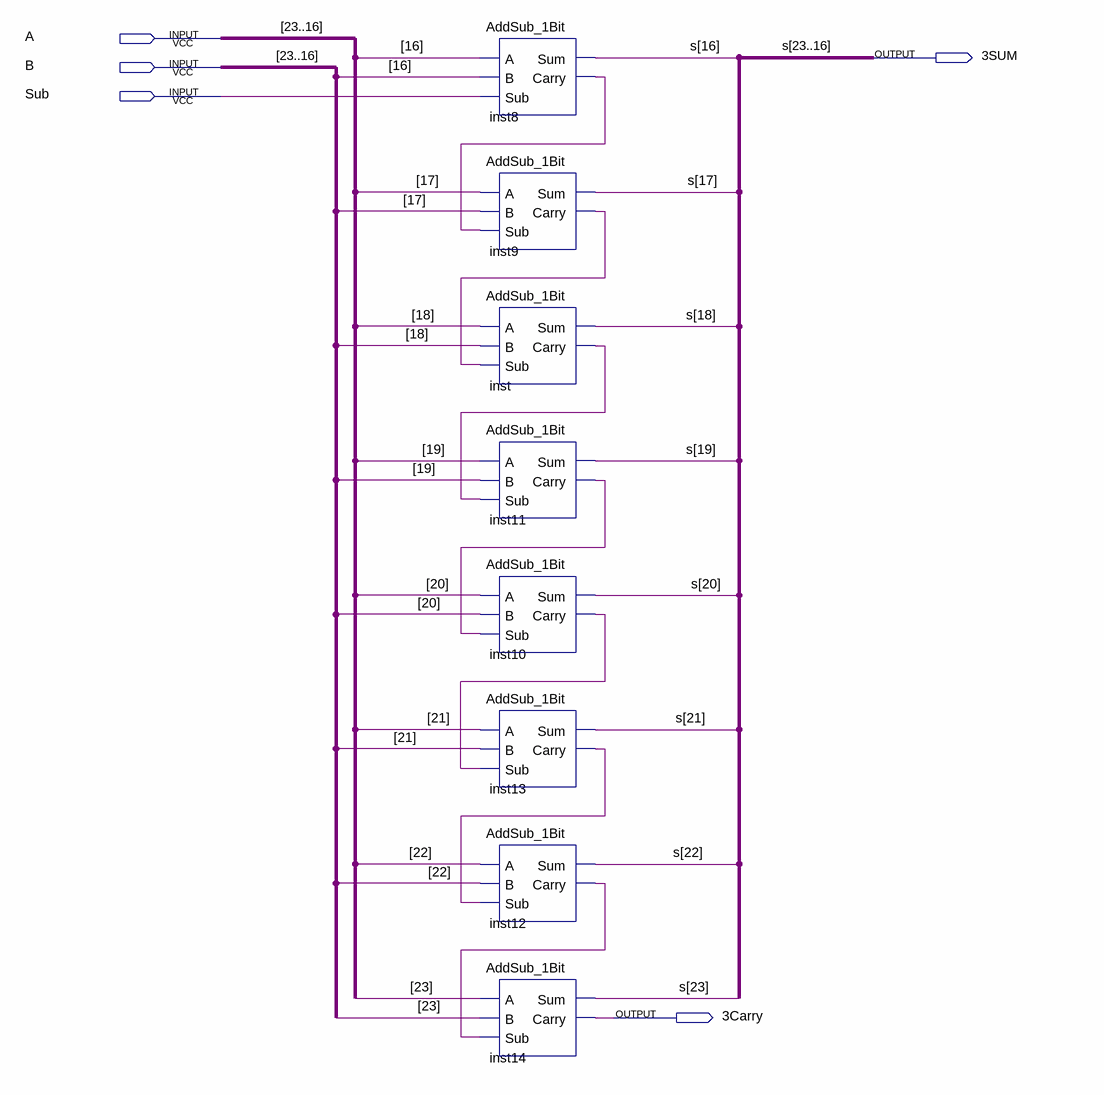
[diagram p0: schematic sheet]
// Quartus schematic Third8Bit_AddSub.bdf as structural Verilog: 8 symbols, 5 pins
module Third8Bit_AddSub (
  input  A,
  input  B,
  input  Sub,
  output \3SUM ,
  output \3Carry 
);

  wire inst8_carry, inst9_carry, inst10_carry, inst11_carry, inst12_carry, inst13_carry, inst_carry;
  wire [23:16] s;

  AddSub_1Bit inst8 (.A(A), .B(B), .Sub(Sub), .Sum(s[16]), .Carry(inst8_carry));
  AddSub_1Bit inst9 (.A(A), .B(B), .Sub(inst8_carry), .Sum(s[17]), .Carry(inst9_carry));
  AddSub_1Bit inst (.A(A), .B(B), .Sub(inst9_carry), .Sum(s[18]), .Carry(inst_carry));
  AddSub_1Bit inst11 (.A(A), .B(B), .Sub(inst_carry), .Sum(s[19]), .Carry(inst11_carry));
  AddSub_1Bit inst10 (.A(A), .B(B), .Sub(inst11_carry), .Sum(s[20]), .Carry(inst10_carry));
  AddSub_1Bit inst13 (.A(A), .B(B), .Sub(inst10_carry), .Sum(s[21]), .Carry(inst13_carry));
  AddSub_1Bit inst12 (.A(A), .B(B), .Sub(inst13_carry), .Sum(s[22]), .Carry(inst12_carry));
  AddSub_1Bit inst14 (.A(A), .B(B), .Sub(inst12_carry), .Sum(s[23]), .Carry(\3Carry ));
endmodule
